# Altium schematic sheet STlink.SchDoc: STLINK-V3MODS & Level Shifter
size A4; Date: Not used; ApprovedBy: Not used; CheckedBy: Not used; Author: Not used; CompanyName: STMicroelectronics; DrawnBy: Not used; Engineer: Not used; Organization: Not used; Address1: Not used; Address2: Not used; Address3: Not used; Address4: Not used; DocumentNumber: Not used; Revision: Not used; SheetNumber: 6; SheetTotal: 6; CurrentTime: Not used; CurrentDate: Not used; Time: Not used; DocumentFullPathAndName: Not used; DocumentName: Not used; ModifiedDate: Not used; ImagePath: Not used; ProjectName: Not used; Application_BuildNumber: Not used
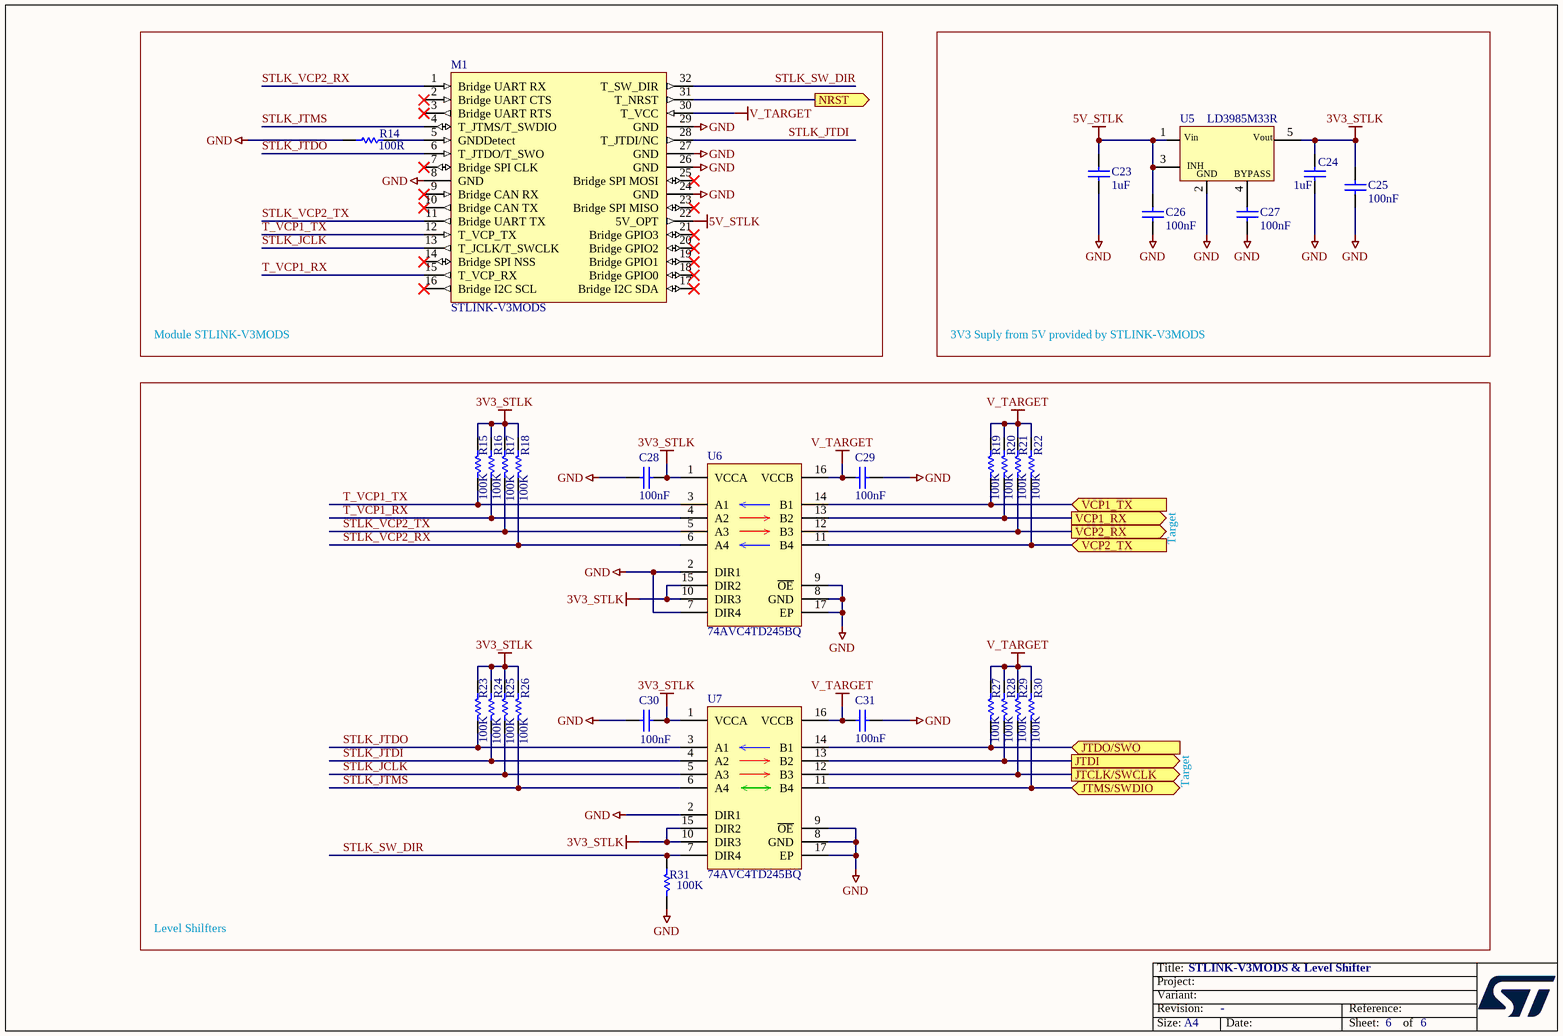
[diagram p0: STlink.SchDoc]

## Parts
C23  value 1uF  [C0402]  (hidden comment: Capacitor)
C24  value 1uF  [C0402]  (hidden comment: Capacitor)
C25  value 100nF  [C0402]  (hidden comment: Capacitor)
C26  value 100nF  [C0402]  (hidden comment: Capacitor)
C27  value 100nF  [C0402]  (hidden comment: Capacitor)
C28  value 100nF  [C0402]  (hidden comment: Capacitor)
C29  value 100nF  [C0402]  (hidden comment: Capacitor)
C30  value 100nF  [C0402]  (hidden comment: Capacitor)
C31  value 100nF  [C0402]  (hidden comment: Capacitor)
M1  STLINK-V3MODS  [MOD_STLINK-V3M_MB1467]
R14  value 100R  [R0402]  (hidden comment: Resistor)
R15  value 100K  [R0402]  (hidden comment: Resistor)
R16  value 100K  [R0402]  (hidden comment: Resistor)
R17  value 100K  [R0402]  (hidden comment: Resistor)
R18  value 100K  [R0402]  (hidden comment: Resistor)
R19  value 100K  [R0402]  (hidden comment: Resistor)
R20  value 100K  [R0402]  (hidden comment: Resistor)
R21  value 100K  [R0402]  (hidden comment: Resistor)
R22  value 100K  [R0402]  (hidden comment: Resistor)
R23  value 100K  [R0402]  (hidden comment: Resistor)
R24  value 100K  [R0402]  (hidden comment: Resistor)
R25  value 100K  [R0402]  (hidden comment: Resistor)
R26  value 100K  [R0402]  (hidden comment: Resistor)
R27  value 100K  [R0402]  (hidden comment: Resistor)
R28  value 100K  [R0402]  (hidden comment: Resistor)
R29  value 100K  [R0402]  (hidden comment: Resistor)
R30  value 100K  [R0402]  (hidden comment: Resistor)
R31  value 100K  [R0402]  (hidden comment: Resistor)
U5  LD3985M33R  [REG_SOT23-5L]
U6  74AVC4TD245BQ  [ICC_DHVQFN16-EPAD_SOT763-1_2P5X3P5_H0P85_P050]
U7  74AVC4TD245BQ  [ICC_DHVQFN16-EPAD_SOT763-1_2P5X3P5_H0P85_P050]

## Blocks framed on the sheet
Module STLINK-V3MODS: M1 R14
3V3 Suply from 5V provided by STLINK-V3MODS: C23-C27 U5

## Ports
JTCLK/SWCLK (out), JTDI (out), JTDO/SWO (in), JTMS/SWDIO (bidir), NRST (out), VCP1_RX (out), VCP1_TX (in), VCP2_RX (out), VCP2_TX (in)

## Nets
3V3_STLK: C24.2 C25.2 C28.1 C30.1 R15.2 R16.2 R17.2 R18.2 R23.2 R24.2 R25.2 R26.2 U5.5(Vout) U6.1(VCCA) U6.10(DIR3) U6.15(DIR2) U7.1(VCCA) U7.10(DIR3) U7.15(DIR2)
5V_STLK: C23.2 C26.2 M1.22(5V_OPT) U5.1(Vin) U5.3(CE)
GND: C23.1 C24.1 C25.1 C26.1 C27.1 C28.2 C29.1 C30.2 C31.1 M1.8(GND) M1.24(GND) M1.26(GND) M1.27(GND) M1.29(GND) R14.1 R31.2 U5.2(GND) U6.2(DIR1) U6.7(DIR4) U6.8(GND) U6.9(~{OE}) U6.17(EP) U7.2(DIR1) U7.8(GND) U7.9(~{OE}) U7.17(EP)
V_TARGET: C29.2 C31.2 M1.30(T_VCC) R19.2 R20.2 R21.2 R22.2 R27.2 R28.2 R29.2 R30.2 U6.16(VCCB) U7.16(VCCB)
JTCLK/SWCLK: R29.1 U7.12(B3) ; port JTCLK/SWCLK
JTDI: R28.1 U7.13(B2) ; port JTDI
JTDO/SWO: R27.1 U7.14(B1) ; port JTDO/SWO
JTMS/SWDIO: R30.1 U7.11(B4) ; port JTMS/SWDIO
NRST: M1.31(T_NRST) ; port NRST
STLK_JCLK: M1.13(T_JCLK/T_SWCLK) R25.1 U7.5(A3)
STLK_JTDI: M1.28(T_JTDI/NC) R24.1 U7.4(A2)
STLK_JTDO: M1.6(T_JTDO/T_SWO) R23.1 U7.3(A1)
STLK_JTMS: M1.4(T_JTMS/T_SWDIO) R26.1 U7.6(A4)
STLK_SW_DIR: M1.32(T_SW_DIR) R31.1 U7.7(DIR4)
STLK_VCP2_RX: M1.1(Bridge_UART_RX) R18.1 U6.6(A4)
STLK_VCP2_TX: M1.11(Bridge_UART_TX) R17.1 U6.5(A3)
T_VCP1_RX: M1.15(T_VCP_RX) R16.1 U6.4(A2)
T_VCP1_TX: M1.12(T_VCP_TX) R15.1 U6.3(A1)
VCP1_RX: R20.1 U6.13(B2) ; port VCP1_RX
VCP1_TX: R19.1 U6.14(B1) ; port VCP1_TX
VCP2_RX: R21.1 U6.12(B3) ; port VCP2_RX
VCP2_TX: R22.1 U6.11(B4) ; port VCP2_TX
NetC27_2: C27.2 U5.4(BYPASS)
NetM1_5: M1.5(GNDDetect) R14.2

Not connected (* = marked no-connect by the designer): M1 2(Bridge_UART_CTS)* 3(Bridge_UART_RTS)* 7(Bridge_SPI_CLK)* 9(Bridge_CAN_RX)* 10(Bridge_CAN_TX)* 14(Bridge_SPI_NSS)* 16(Bridge_I2C_SCL)* 17(Bridge_I2C_SDA)* 18(Bridge_GPIO0)* 19(Bridge_GPIO1)* 20(Bridge_GPIO2)* 21(Bridge_GPIO3)* 23(Bridge_SPI_MISO)* 25(Bridge_SPI_MOSI)*

## Notes on the sheet
- Target
- Level Shilfters
- Title:
- Project:
- Size:
- Revision:
- Variant:
- A4
- -
- Date:
- Reference:
- Sheet:
- of
- (in symbol MCD-00086) INH

## Library data of the parts
C23 C24 = MCD-01722: Capacitor, MLCC, 1uF, 10V, X5R, +/-10%, 0402, T=0.5mm; Manufacturer_Part_Number: CC0402KRX5R6BB105; Manufacturer: YAGEO; Part_Preference: Recommended; Component_Country_Of_Origin: China; Internal_Part_Number: MCD-01722; Status: Released; Part_Type: Capacitor; Package: 0402; ComponentLink1URL: http://tunmcdsvn.tun.st.com/Component_Documentation_Library/Trunk/Capacitor/YAGEO_X5R_Series; Order_Code_Digikey: 311-1439-1-ND; Order_Code_Farnell: 1458896; Order_Code_RS: N/A
C25-C31 = MCD-02355: Capacitor, MLCC, 100nF, 25V, X7R, +/-10%, 0402, T=0.5mm; Part_Preference: Recommended; Manufacturer: WALSIN; Manufacturer_Part_Number: 0402B104K250CT; Order_Code_RS: 176-3114; Component_Country_Of_Origin: Unknown; Internal_Part_Number: MCD-02355; Status: Checked; Part_Type: Capacitor; Package: 0402; ComponentLink1URL: http://tunmcdsvn.tun.st.com/Component_Documentation_Library/Trunk/Capacitor/WALSIN_Monolithic_Series/; Order_Code_Digikey: 1292-1175-1-ND; Order_Code_Farnell: 2496772
M1 = MCD-01983: STLINK-V3MODS module; Part_Type: Misc; Part_Preference: Recommended; Manufacturer: STMICROELECTRONICS; Manufacturer_HQ_COO: EU; Order_Code_RS: 200-6065; Component_Country_Of_Origin: Unknown; Internal_Part_Number: MCD-01983; Value: STLINK-V3MODS; Status: Checked; Manufacturer_Part_Number: STLINK-V3MODS; ComponentLink1URL: http://tunmcdsvn.tun.st.com/Component_Datasheet_Library/Trunk/Misc/STM_STLINK-V3MODS; Order_Code_Digikey: 497-STLINK-V3MODS-ND; Order_Code_Farnell: 3381462
R14 = MCD-00119: Resistor, 100R, 0402, +/-1%, 1/16W; Part_Preference: Not recommended; Manufacturer: YAGEO; Manufacturer_Part_Number: RC0402FR-07100RL; Component_Country_Of_Origin: China; Internal_Part_Number: MCD-00119; Status: Checked; Part_Type: Resistor; Package: 0402; ComponentLink1URL: http://tunmcdsvn.tun.st.com/Component_Documentation_Library/Trunk/Resistor/YAGEO_RC_L_Series; Order_Code_Digikey: 311-100LRCT-ND; Order_Code_Farnell: 9239111; Order_Code_RS: N/A
R15-R31 = MCD-00059: Resistor, 100K, 0402, +/-1%, 1/16W; Manufacturer_Part_Number: RC0402FR-07100KL; Manufacturer: YAGEO; Part_Preference: Recommended; Component_Country_Of_Origin: China; Internal_Part_Number: MCD-00059; Status: Released; Part_Type: Resistor; Package: 0402; ComponentLink1URL: http://tunmcdsvn.tun.st.com/Component_Documentation_Library/Trunk/Resistor/YAGEO_RC_L_Series; Order_Code_Digikey: 311-100KLRTR-ND; Order_Code_Farnell: 2421891; Order_Code_RS: N/A
U5 = MCD-00086: Ultra low drop-low noise BiCMOS voltage, regulators low ESR capacitors compatible; Part_Type: IC; Manufacturer: STMICROELECTRONICS; BMS_Part_Number: 9176161; Part_Preference: Recommended; Manufacturer_HQ_COO: EU; Component_Country_Of_Origin: China; Internal_Part_Number: MCD-00086; Value: LD3985M33R; Status: Released; Manufacturer_Part_Number: LD3985M33R; ComponentLink1URL: http://tunmcdsvn.tun.st.com/Component_Datasheet_Library/Trunk/IC/STM_LDO_LD3985
U6 U7 = MCD-01945: 4-bit dual supply translating transceiver with configurable voltage translation; 3-state; Part_Type: IC; Manufacturer_Part_Number: 74AVC4TD245BQ,115; Manufacturer: NEXPERIA; Part_Preference: Recommended; Component_Country_Of_Origin: Thailand; Internal_Part_Number: MCD-01945; Value: 74AVC4TD245BQ; Status: Released; Package: DHVQFN16; ComponentLink1URL: http://tunmcdsvn.tun.st.com/Component_Datasheet_Library/Trunk/IC/NEXPERIA_dual supply transceiver_74AVC4TD245; Order_Code_Digikey: 1727-6899-1-ND; Order_Code_Farnell: N/A; Order_Code_RS: N/A